# Altium project SOMA_25042022.PrjPcb (part 2 of 2)

## Sheet 04_BLE & WIFI module.SchDoc
size A4
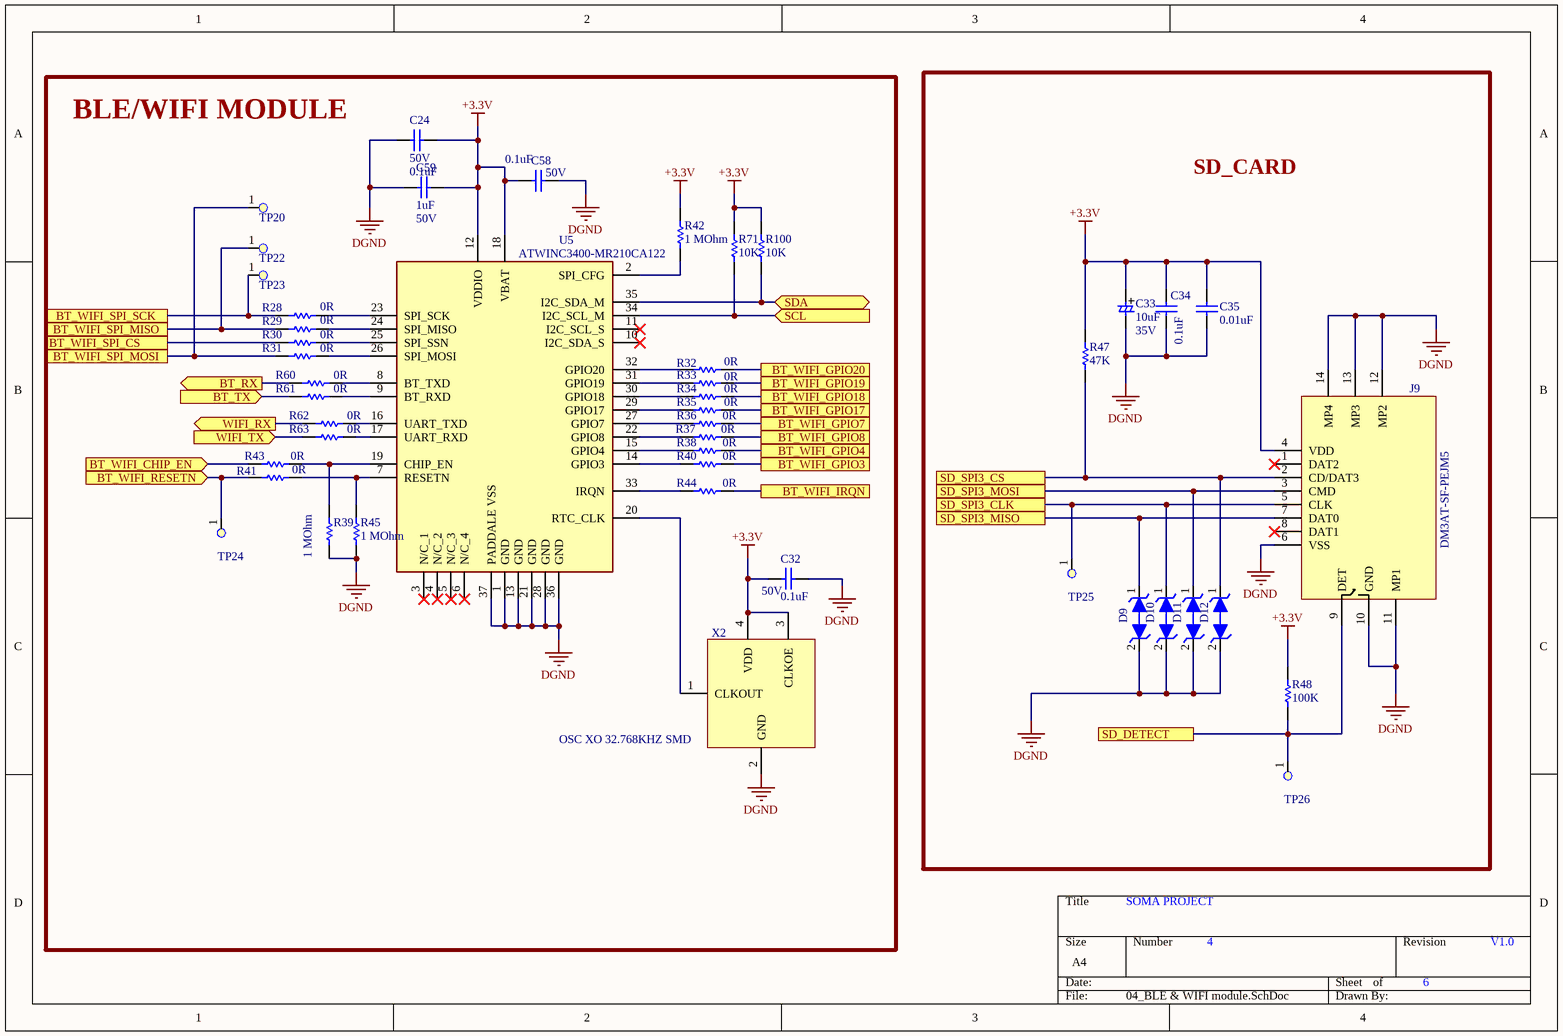
[diagram p3: 04_BLE & WIFI module.SchDoc]

### Parts
C24  Rating: 50V  [C0402]  (hidden comment: 0.1uF)
C32  Rating: 50V  [C0402]  (hidden comment: 0.1uF)
C33  Rating: 35V  [CAPAE430X540N]  (hidden comment: 10uF)
C34  0.1uF  [C0603]
C35  0.01uF  [C0402]
C58  Rating: 50V  [C0402]  (hidden comment: 0.1uF)
C59  value 1uF  Rating: 50V  [C0603]  (hidden comment: CAP CER 1UF 50V X5R 0603)
D9  TVS DIODE 3.3VWM 11.5VC SOD923  [SOD1006X40N_BI]  (value not drawn)
D10  TVS DIODE 3.3VWM 11.5VC SOD923  [SOD1006X40N_BI]  (value not drawn)
D11  TVS DIODE 3.3VWM 11.5VC SOD923  [SOD1006X40N_BI]  (value not drawn)
D12  TVS DIODE 3.3VWM 11.5VC SOD923  [SOD1006X40N_BI]  (value not drawn)
J9  value DM3AT-SF-PEJM5  [HIROSE_DM3AT-SF-PEJM5]  (hidden comment: CONN MICRO SD CARD PUSH-PUSH R/A)
R28  value 0R  [R0402]  (hidden comment: RES SMD 0 OHM JUMPER 1/16W 0402)
R29  value 0R  [R0402]  (hidden comment: RES SMD 0 OHM JUMPER 1/16W 0402)
R30  value 0R  [R0402]  (hidden comment: RES SMD 0 OHM JUMPER 1/16W 0402)
R31  value 0R  [R0402]  (hidden comment: RES SMD 0 OHM JUMPER 1/16W 0402)
R32  value 0R  [R0402]  (hidden comment: RES SMD 0 OHM JUMPER 1/16W 0402)
R33  value 0R  [R0402]  (hidden comment: RES SMD 0 OHM JUMPER 1/16W 0402)
R34  value 0R  [R0402]  (hidden comment: RES SMD 0 OHM JUMPER 1/16W 0402)
R35  value 0R  [R0402]  (hidden comment: RES SMD 0 OHM JUMPER 1/16W 0402)
R36  value 0R  [R0402]  (hidden comment: RES SMD 0 OHM JUMPER 1/16W 0402)
R37  value 0R  [R0402]  (hidden comment: RES SMD 0 OHM JUMPER 1/16W 0402)
R38  value 0R  [R0402]  (hidden comment: RES SMD 0 OHM JUMPER 1/16W 0402)
R39  1 MOhm  [R0603]
R40  value 0R  [R0402]  (hidden comment: RES SMD 0 OHM JUMPER 1/16W 0402)
R41  value 0R  [R0402]  (hidden comment: RES SMD 0 OHM JUMPER 1/16W 0402)
R42  1 MOhm  [R0603]
R43  value 0R  [R0402]  (hidden comment: RES SMD 0 OHM JUMPER 1/16W 0402)
R44  value 0R  [R0402]  (hidden comment: RES SMD 0 OHM JUMPER 1/16W 0402)
R45  1 MOhm  [R0603]
R47  47K  [R0402]
R48  100K  [R0402]
R60  value 0R  [R0402]  (hidden comment: RES SMD 0 OHM JUMPER 1/16W 0402)
R61  value 0R  [R0402]  (hidden comment: RES SMD 0 OHM JUMPER 1/16W 0402)
R62  value 0R  [R0402]  (hidden comment: RES SMD 0 OHM JUMPER 1/16W 0402)
R63  value 0R  [R0402]  (hidden comment: RES SMD 0 OHM JUMPER 1/16W 0402)
R71  10K  [R0402]
R100  10K  [R0402]
TP20  Test Point,1.6mm Diameter,SMD  [TP_63C]  (value not drawn)  (no BOM)
TP22  Test Point,1.6mm Diameter,SMD  [TP_63C]  (value not drawn)  (no BOM)
TP23  Test Point,1.6mm Diameter,SMD  [TP_63C]  (value not drawn)  (no BOM)
TP24  Test Point,1.6mm Diameter,SMD  [TP_63C]  (value not drawn)  (no BOM)
TP25  Test Point,1.6mm Diameter,SMD  [TP_63C]  (value not drawn)  (no BOM)
TP26  Test Point,1.6mm Diameter,SMD  [TP_63C]  (value not drawn)  (no BOM)
U5  value ATWINC3400-MR210CA122  [MICROCHIP_ATWINC3400-MR210xA]  (hidden comment: RX TXRX MODULE WIFI CHIP SMD)
X2  OSC XO 32.768KHZ SMD  [XTAL320X150X70-4N]

### Blocks framed on the sheet
BLE/WIFI MODULE: C24 C32 C58 C59 R28-R45 R60-R63 R71 R100 TP20 TP22-TP24 U5 X2
SD_CARD: C33-C35 D9-D12 J9 R47 R48 TP25 TP26

### Ports
BT_RX (out), BT_TX (in), BT_WIFI_CHIP_EN (in), BT_WIFI_GPIO3, BT_WIFI_GPIO4, BT_WIFI_GPIO7, BT_WIFI_GPIO8, BT_WIFI_GPIO17, BT_WIFI_GPIO18, BT_WIFI_GPIO19, BT_WIFI_GPIO20, BT_WIFI_IRQN, BT_WIFI_RESETN (in), BT_WIFI_SPI_CS, BT_WIFI_SPI_MISO, BT_WIFI_SPI_MOSI, BT_WIFI_SPI_SCK, SCL (in), SD_DETECT, SD_SPI3_CLK, SD_SPI3_CS, SD_SPI3_MISO, SD_SPI3_MOSI, SDA (bidir), WIFI_RX (out), WIFI_TX (in)

### Nets
+3.3V: C24.1 C32.2 C33.2 C34.2 C35.2 C58.2 C59.1 J9.4(VDD) R42.1 R47.2 R48.2 R71.2 R100.2 U5.12(VDDIO) U5.18(VBAT) X2.3(CLKOE) X2.4(VDD)
DGND: C24.2 C32.1 C33.1 C34.1 C35.1 C58.1 C59.2 D9.2(A) D10.2(A) D11.2(A) D12.2(A) J9.6(VSS) J9.10(GND) J9.11(MP1) J9.12(MP2) J9.13(MP3) J9.14(MP4) R39.2 R45.1 U5.1(GND) U5.13(GND) U5.21(GND) U5.28(GND) U5.36(GND) U5.37(PADDALE_VSS) X2.2(GND)
BT_RX: R60.1 ; port BT_RX
BT_TX: R61.1 ; port BT_TX
BT_WIFI_CHIP_EN: R43.1 ; port BT_WIFI_CHIP_EN
BT_WIFI_GPIO3: R40.2 ; port BT_WIFI_GPIO3
BT_WIFI_GPIO4: R38.2 ; port BT_WIFI_GPIO4
BT_WIFI_GPIO7: R36.2 ; port BT_WIFI_GPIO7
BT_WIFI_GPIO8: R37.2 ; port BT_WIFI_GPIO8
BT_WIFI_GPIO17: R35.2 ; port BT_WIFI_GPIO17
BT_WIFI_GPIO18: R34.2 ; port BT_WIFI_GPIO18
BT_WIFI_GPIO19: R33.2 ; port BT_WIFI_GPIO19
BT_WIFI_GPIO20: R32.2 ; port BT_WIFI_GPIO20
BT_WIFI_IRQN: R44.2 ; port BT_WIFI_IRQN
BT_WIFI_RESETN: R41.1 TP24.1 ; port BT_WIFI_RESETN
BT_WIFI_SPI_CS: R30.1 ; port BT_WIFI_SPI_CS
BT_WIFI_SPI_MISO: R29.1 TP22.1 ; port BT_WIFI_SPI_MISO
BT_WIFI_SPI_MOSI: R31.1 TP20.1 ; port BT_WIFI_SPI_MOSI
BT_WIFI_SPI_SCK: R28.1 TP23.1 ; port BT_WIFI_SPI_SCK
SCL: R71.1 U5.34(I2C_SCL_M) ; port SCL
SD_DETECT: J9.9(DET) R48.1 TP26.1 ; port SD_DETECT
SD_SPI3_CLK: D10.1(K) J9.5(CLK) TP25.1 ; port SD_SPI3_CLK
SD_SPI3_CS: D12.1(K) J9.2(CD/DAT3) R47.1 ; port SD_SPI3_CS
SD_SPI3_MISO: D9.1(K) J9.7(DAT0) ; port SD_SPI3_MISO
SD_SPI3_MOSI: D11.1(K) J9.3(CMD) ; port SD_SPI3_MOSI
SDA: R100.1 U5.35(I2C_SDA_M) ; port SDA
WIFI_RX: R62.1 ; port WIFI_RX
WIFI_TX: R63.1 ; port WIFI_TX
NetR28_2: R28.2 U5.23(SPI_SCK)
NetR29_2: R29.2 U5.24(SPI_MISO)
NetR30_2: R30.2 U5.25(SPI_SSN)
NetR31_2: R31.2 U5.26(SPI_MOSI)
NetR32_1: R32.1 U5.32(GPIO20)
NetR33_1: R33.1 U5.31(GPIO19)
NetR34_1: R34.1 U5.30(GPIO18)
NetR35_1: R35.1 U5.29(GPIO17)
NetR36_1: R36.1 U5.27(GPIO7)
NetR37_1: R37.1 U5.22(GPIO8)
NetR38_1: R38.1 U5.15(GPIO4)
NetR39_1: R39.1 R43.2 U5.19(CHIP_EN)
NetR40_1: R40.1 U5.14(GPIO3)
NetR41_2: R41.2 R45.2 U5.7(RESETN)
NetR42_2: R42.2 U5.2(SPI_CFG)
NetR44_1: R44.1 U5.33(IRQN)
NetR60_2: R60.2 U5.8(BT_TXD)
NetR61_2: R61.2 U5.9(BT_RXD)
NetR62_2: R62.2 U5.16(UART_TXD)
NetR63_2: R63.2 U5.17(UART_RXD)
NetU5_20: U5.20(RTC_CLK) X2.1(CLKOUT)

Not connected (* = marked no-connect by the designer): J9 1(DAT2)* 8(DAT1)*; U5 3(N/C_1)* 4(N/C_2)* 5(N/C_3)* 6(N/C_4)* 10(I2C_SDA_S)* 11(I2C_SCL_S)*

### Notes on the sheet
- SOMA PROJECT
- 4
- 6
- V1.0

### Library data of the parts
C24 C32 C58 = CAP CER 0.1UF 50V X7R 0402: Manufacturer: AVX; Manufacturer part Number: 04025C104KAT2A; Tolerance: ±10%; Distributor: Mouser; Package: 0402; Type: CAP; Operating Temperature: -55°C ~ 125°C; Distributor part Number: 581-04025C104KAT2A; Reference link: https://www.mouser.in/ProductDetail/AVX/04025C104KAT2A?qs=%2Fha2pyFaduhvAwOoQhW9hDDlPxePcbvdgYQJEdBTMGpxgpoTOSNvPA%3D%3D; Value: 0.1uF; Unit Price: ₹7.47
C33 = CAP ALUM 10UF 20% 35V SMD: Manufacturer: Panasonic; Manufacturer part Number: EEE-1VA100WR; Operating Temperature: 40°C ~ 85°C; Package: 0.169" L x 0.169" W (4.30mm x 4.30mm); Reference link: https://www.digikey.com/product-detail/en/panasonic-electronic-components/EEE-1VA100WR/PCE3948TR-ND/761836; Distributor: Digi-Key; Distributor part Number: PCE3948TR-ND; Type: CAP; Tolerance: ±20%; Value: 10uF; Unit Price: $0.08326
C34 = CAP CER 0.1UF 10V X7R 0603: Manufacturer: Würth Elektronik; Manufacturer part Number: 885012206020; Tolerance: ±10%; Operating Temperature: -55°C ~ 125°C; Reference link: https://www.digikey.com/en/products/detail/w%C3%BCrth-elektronik/885012206020/5453794; Package: 0603 (1608 Metric); Distributor: Digikey; Distributor part Number: 732-7939-1-ND; Type: CAP; Unit Price: $0.10000; Value: 0.1uF; Rating: 10V
C35 = CAP CER 0.01uF 50V X7R 0402: Manufacturer: Yageo; Manufacturer part Number: CC0402KRX7R9BB103; Tolerance: ±10%; Operating Temperature: -55°C ~ 125°C; Package: 0402; Distributor: Digikey; Reference link: https://www.digikey.in/product-detail/en/yageo/CC0402KRX7R9BB103/311-1349-1-ND/2103133; Distributor part Number: 311-1349-1-ND; Type: CAP; Rating: 50V; Value: 0.01uF; Unit Price: 0.00609
C59 = CAP CER 1UF 50V X5R 0603: Manufacturer: Taiyo Yuden; Manufacturer part Number: UMK107BJ105KA-T; Tolerance: ±10%; Operating Temperature: -55°C ~ 125°C; Reference link: https://www.digikey.in/product-detail/en/taiyo-yuden/UMK107BJ105KA-T/587-2400-2-ND/2178919; Package: 0603; Distributor: Digikey; Distributor part Number: 587-2400-2-ND; Type: CAP; Unit Price: 2.57370
D9-D12 = TVS DIODE 3.3VWM 11.5VC SOD923: 11.5V Clamp 2A (8/20µs) Ipp Tvs Diode Surface Mount SOD-923; Manufacturer Part Number: ESD9B3.3ST5G; Manufacturer: ON Semiconductor; Value: 3.3V 11.5V; Assembly Option: DNP; Tolerance: NA; Operating Temperature: -55°C to +150°C; Distributor: Digikey; Distributor part Number: ESD9B3.3ST5GOSTR-ND; Package: SOD-923; Rating: 3.3V 11.5V; Reference link: https://www.digikey.com/product-detail/en/on-semiconductor/ESD9B3.3ST5G/ESD9B3.3ST5GOSTR-ND/1973669; Type: TVS; Unit Price: $0.24000
J9 = CONN MICRO SD CARD PUSH-PUSH R/A: Manufacturer: Hirose Electric Co Ltd; Rating: NA; Unit Price: $2.50000; Distributor: Digikey; Distributor part Number: HR1964CT-ND; Manufacturer part Number: DM3AT-SF-PEJM5; Reference link: https://www.digikey.com/en/products/detail/hirose-electric-co-ltd/DM3AT-SF-PEJM5/2533565; Tolerance: NA; Type: Connector and Ejector
R28-R38 R40 R41 R43 R44 R60-R63 = RES SMD 0 OHM JUMPER 1/16W 0402: 0 Ohms Jumper 0.063W, 1/16W Chip Resistor 0402 (1005 Metric) Moisture Resistant Thick Film; Manufacturer: Yageo; Manufacturer part Number: RC0402JR-070RP; Distributor: Digikey; Distributor part Number: YAG1279TR-ND; Unit Price: 0.00377; Reference link: https://www.digikey.sg/product-detail/en/yageo/RC0402JR-070RP/YAG1279TR-ND/4935294; Type: RES; Rating: 0.063W, 1/16W; Package: 0402 (1005 Metric); Tolerance: Jumper; Part Status: Active; Operating Temperature: -55°C ~ 155°C; Size / Dimension: 0.039" L x 0.020" W (1.00mm x 0.50mm)
R39 R42 R45 = RES 1M OHM 1% 1/10W 0603: Manufacturer part Number: RC0603FR-131ML; Manufacturer: Yageo; Operating Temperature: -55°C ~ 155°C; Distributor: Digikey; Package: 0603 (1608 Metric); Type: RES; Distributor part Number: 13-RC0603FR-131MLCT-ND; Reference link: https://www.digikey.com/en/products/detail/yageo/RC0603FR-131ML/13694152; Rating: 1/10W; Unit Price: $0.10000; Value: 1 MOhm
R47 = RES SMD 47K OHM 5% 1/10W 0402: Manufacturer part Number: ERJ-2GEJ473X; Manufacturer: Panasonic Electronic Components; Assembly Option: DNP; Distributor: Digikey; Reference link: https://www.digikey.in/product-detail/en/panasonic-electronic-components/ERJ-2GEJ473X/P47KJCT-ND/147021; Type: RES; Distributor part Number: P47KJCT-ND; Rating: 1/10W; Tolerance: ±5%; Package: 0402; Operating Temperature: -55°C ~ 155°C; Value: 47K; Unit Price: 7.46000
R48 = RES SMD 100K OHM 1% 1/10W 0402: 100 kOhms ±1% 0.1W, 1/10W Chip Resistor 0402 (1005 Metric) Automotive AEC-Q200 Thick Film; Manufacturer: Panasonic Electronic Components; Manufacturer part Number: ERJ-2RKF1003X; Operating Temperature: -55°C ~ 155°C; Package: 0402; Distributor: Digikey; Type: RES; Reference link: https://www.digikey.in/product-detail/en/panasonic-electronic-components/ERJ-2RKF1003X/P100KLCT-ND/194127; Distributor part Number: P100KLCT-ND; Tolerance: ±1%; Rating: 1/10W; Value: 100K; Unit Price: 7.46000
R71 R100 = RES SMD 10K OHM 1% 1/10W 0402: 10 kOhms ±1% 0.1W, 1/10W Chip Resistor 0402 (1005 Metric) Automotive AEC-Q200 Thick Film; Manufacturer: Panasonic Electronic Components; Manufacturer part Number: ERJ-2RKF1002X; Operating Temperature: -55°C ~ 155°C; Reference link: https://www.digikey.in/product-detail/en/panasonic-electronic-components/ERJ-2RKF1002X/P10.0KLCT-ND/194119; Distributor: Digikey; Distributor part Number: P10.0KLCT-ND; Package: 0402; Type: RES; Rating: 1/10W; Cost: 0.00715; Tolerance: ±1%; Value: 10K
U5 = RX TXRX MODULE WIFI CHIP SMD: Manufacturer: Microchip Technology; Tolerance: NA; Rating: 2.5V ~ 4.2V; Distributor part Number: ATWINC3400-MR210CA122-ND; Unit Price: $11.93000; Reference link: https://www.digikey.com/en/products/detail/microchip-technology/ATWINC3400-MR210CA122/7898445; Type: IC; Manufacturer part Number: ATWINC3400-MR210CA122; Distributor: Digikey; Package: Module; Operating Temperature: -40°C ~ 85°C
X2 = OSC XO 32.768KHZ SMD: 32.768 kHz XO (Standard) CMOS Oscillator 1.2V ~ 5.5V Enable/Disable 4-SMD, No Lead; Manufacturer: Micro Crystal AG; Manufacturer part Number: OM-7604-C7-32.768KHZ-20PPM-TA-QC; Value: 1.2V ~ 5.5V,  0.5µA; Distributor: Digikey; Package: 4 SMD, No Lead; Operating Temperature: -40°C ~ 85°C; Type: Crystal; Distributor part Number: 2195-OM-7604-C7-32.768KHZ-20PPM-TA-QCCT-ND; Reference link: https://www.digikey.com/en/products/detail/micro-crystal-ag/OM-7604-C7-32-768KHZ-20PPM-TA-QC/10431069; Rating: 32.768kHz; Unit Price: $1.64000
TP20 TP22-TP26 = Test Point,1.6mm Diameter,SMD: AEMCI Part Number: *; Vendor: *; Vendor ID: *

## Sheet 05_MCU1.SchDoc
size A4
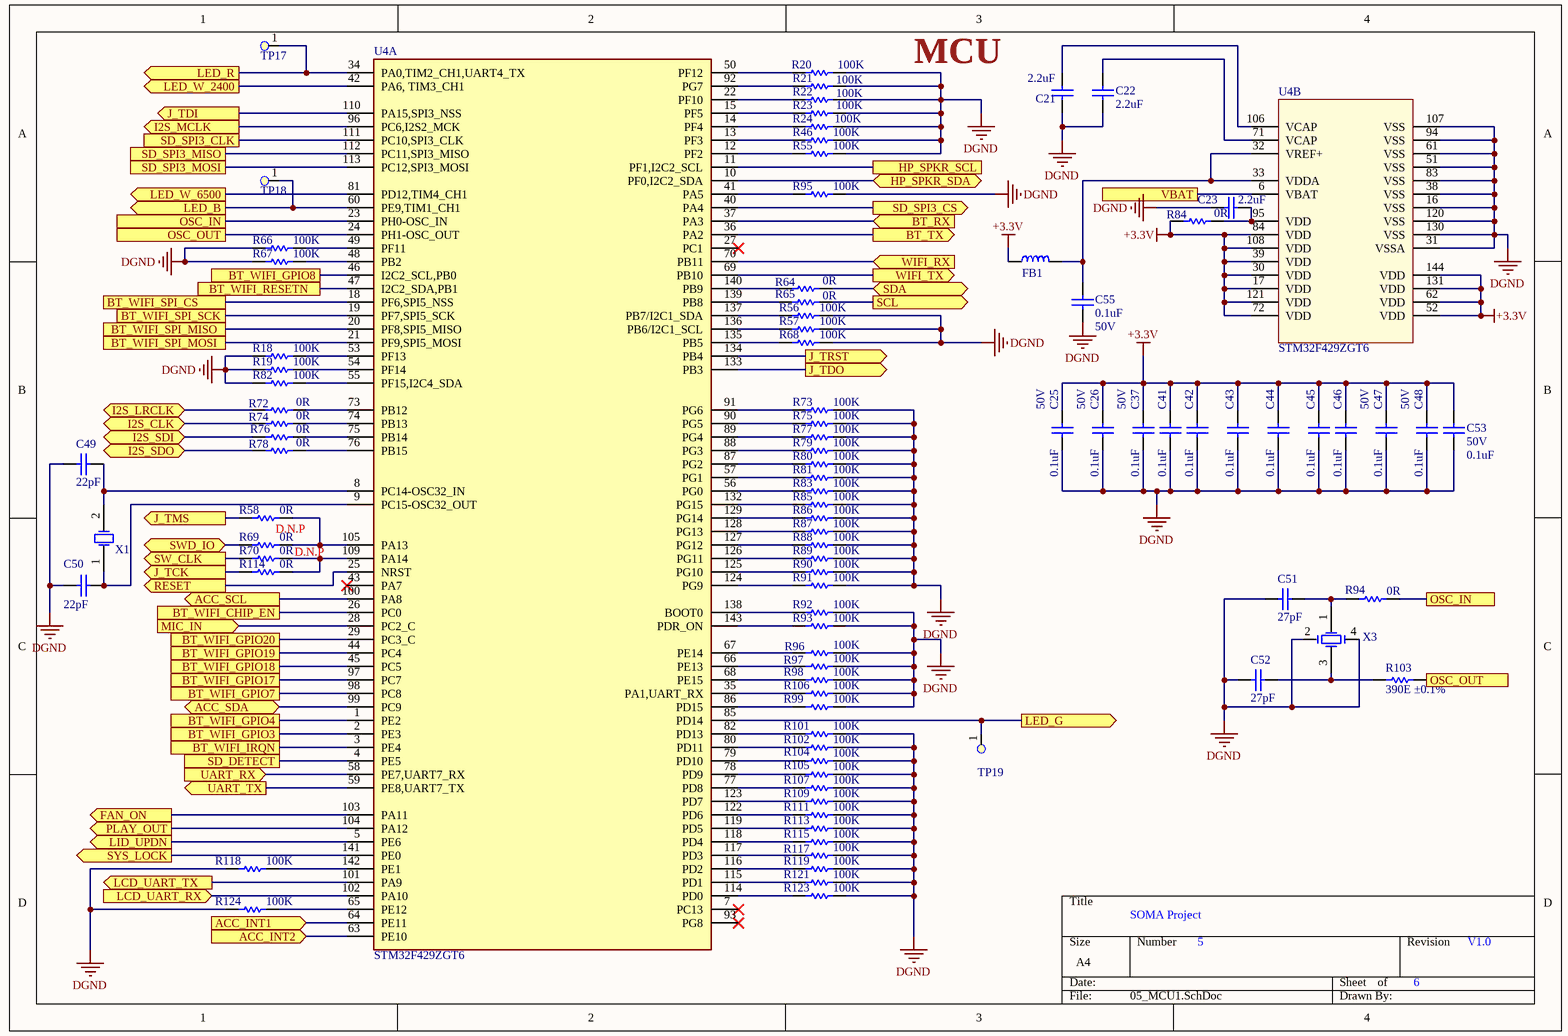
[diagram p4: 05_MCU1.SchDoc]

### Parts
C21  2.2uF  [C0402]
C22  2.2uF  [C0402]
C23  2.2uF  [C0402]
C25  Rating: 50V  [C0402]  (hidden comment: 0.1uF)
C26  Rating: 50V  [C0402]  (hidden comment: 0.1uF)
C37  Rating: 50V  [C0402]  (hidden comment: 0.1uF)
C41  0.1uF  [C0402]
C42  0.1uF  [C0402]
C43  0.1uF  [C0402]
C44  0.1uF  [C0402]
C45  0.1uF  [C0402]
C46  0.1uF  [C0402]
C47  Rating: 50V  [C0402]  (hidden comment: 0.1uF)
C48  Rating: 50V  [C0402]  (hidden comment: 0.1uF)
C49  22pF  [C0402]
C50  22pF  [C0402]
C51  27PF  [C0402]
C52  27PF  [C0402]
C53  Rating: 50V  [C0402]  (hidden comment: 0.1uF)
C55  Rating: 50V  [C0402]  (hidden comment: 0.1uF)
FB1  600 Ohms @ 100MHz  [FB0603]  (value not drawn)
R18  100K  [R0402]
R19  100K  [R0402]
R20  100K  [R0402]
R21  100K  [R0402]
R22  100K  [R0402]
R23  100K  [R0402]
R24  100K  [R0402]
R46  100K  [R0402]
R55  100K  [R0402]
R56  100K  [R0402]
R57  100K  [R0402]
R58  value 0R  [R0402]  (hidden comment: RES SMD 0 OHM JUMPER 1/16W 0402)
R64  value 0R  [R0402]  (hidden comment: RES SMD 0 OHM JUMPER 1/16W 0402)
R65  value 0R  [R0402]  (hidden comment: RES SMD 0 OHM JUMPER 1/16W 0402)
R66  100K  [R0402]
R67  100K  [R0402]
R68  100K  [R0402]
R69  value 0R  Assembly Option: D.N.P  [R0402]  (hidden comment: RES SMD 0 OHM JUMPER 1/16W 0402)
R70  value 0R  Assembly Option: D.N.P  [R0402]  (hidden comment: RES SMD 0 OHM JUMPER 1/16W 0402)
R72  value 0R  [R0402]  (hidden comment: RES SMD 0 OHM JUMPER 1/16W 0402)
R73  100K  [R0402]
R74  value 0R  [R0402]  (hidden comment: RES SMD 0 OHM JUMPER 1/16W 0402)
R75  100K  [R0402]
R76  value 0R  [R0402]  (hidden comment: RES SMD 0 OHM JUMPER 1/16W 0402)
R77  100K  [R0402]
R78  value 0R  [R0402]  (hidden comment: RES SMD 0 OHM JUMPER 1/16W 0402)
R79  100K  [R0402]
R80  100K  [R0402]
R81  100K  [R0402]
R82  100K  [R0402]
R83  100K  [R0402]
R84  value 0R  [R0402]  (hidden comment: RES SMD 0 OHM JUMPER 1/16W 0402)
R85  100K  [R0402]
R86  100K  [R0402]
R87  100K  [R0402]
R88  100K  [R0402]
R89  100K  [R0402]
R90  100K  [R0402]
R91  100K  [R0402]
R92  100K  [R0402]
R93  100K  [R0402]
R94  value 0R  [R0402]  (hidden comment: RES SMD 0 OHM JUMPER 1/16W 0402)
R95  100K  [R0402]
R96  100K  [R0402]
R97  100K  [R0402]
R98  100K  [R0402]
R99  100K  [R0402]
R101  100K  [R0402]
R102  100K  [R0402]
R103  value 390E ±0.1%  [R0603]  (hidden comment: RES SMD 390 OHM 0.1% 1/5W 0603)
R104  100K  [R0402]
R105  100K  [R0402]
R106  100K  [R0402]
R107  100K  [R0402]
R109  100K  [R0402]
R111  100K  [R0402]
R113  100K  [R0402]
R114  value 0R  [R0402]  (hidden comment: RES SMD 0 OHM JUMPER 1/16W 0402)
R115  100K  [R0402]
R117  100K  [R0402]
R118  100K  [R0402]
R119  100K  [R0402]
R121  100K  [R0402]
R123  100K  [R0402]
R124  100K  [R0402]
TP17  Test Point,1.6mm Diameter,SMD  [TP_63C]  (value not drawn)  (no BOM)
TP18  Test Point,1.6mm Diameter,SMD  [TP_63C]  (value not drawn)  (no BOM)
TP19  Test Point,1.6mm Diameter,SMD  [TP_63C]  (value not drawn)  (no BOM)
U4  STM32F429ZGT6  [QFP50P2200X2200X160-144N]  (parts A,B of 2)
X1  32.7680KHZ  [XTAL320X150X90-2N]  (value not drawn)
X3  8MHz  [XTAL600X360X120-4N]  (value not drawn)

### Ports
ACC_INT1 (in), ACC_INT2 (in), ACC_SCL (out), ACC_SDA (bidir), BT_RX (in), BT_TX (out), BT_WIFI_CHIP_EN, BT_WIFI_GPIO3, BT_WIFI_GPIO4, BT_WIFI_GPIO7, BT_WIFI_GPIO8, BT_WIFI_GPIO17, BT_WIFI_GPIO18, BT_WIFI_GPIO19, BT_WIFI_GPIO20, BT_WIFI_IRQN, BT_WIFI_RESETN, BT_WIFI_SPI_CS, BT_WIFI_SPI_MISO, BT_WIFI_SPI_MOSI, BT_WIFI_SPI_SCK, FAN_ON (out), HP_SPKR_SCL, HP_SPKR_SDA (bidir), I2S_CLK (bidir), I2S_LRCLK (bidir), I2S_MCLK (out), I2S_SDI (bidir), I2S_SDO (bidir), J_TCK (out), J_TDI (out), J_TDO (out), J_TMS (out), J_TRST (out), LCD_UART_RX (in), LCD_UART_TX (out), LED_B (out), LED_G (out), LED_R (out), LED_W_2400 (out), LED_W_6500 (out), LID_UPDN (out), MIC_IN (in), OSC_IN, OSC_OUT, PLAY_OUT (out), RESET (out), SCL (out), SD_DETECT, SD_SPI3_CLK, SD_SPI3_CS (out), SD_SPI3_MISO, SD_SPI3_MOSI, SDA (bidir), SW_CLK (out), SWD_IO (bidir), SYS_LOCK (out), UART_RX (in), UART_TX (out), VBAT, WIFI_RX (in), WIFI_TX (out)

### Nets
+3.3V: C25.2 C26.2 C37.2 C41.2 C42.2 C43.2 C44.2 C45.2 C46.2 C47.2 C48.2 C53.2 FB1.2 R84.1 U4.17(VDD) U4.30(VDD) U4.39(VDD) U4.52(VDD) U4.62(VDD) U4.72(VDD) U4.84(VDD) U4.108(VDD) U4.121(VDD) U4.131(VDD) U4.144(VDD)
DGND: C21.2 C22.2 C23.1 C25.1 C26.1 C37.1 C41.1 C42.1 C43.1 C44.1 C45.1 C46.1 C47.1 C48.1 C49.1 C50.1 C51.1 C52.1 C53.1 C55.1 R18.1 R19.1 R20.2 R21.2 R22.2 R23.2 R24.2 R46.2 R55.2 R56.2 R57.2 R66.1 R67.1 R68.2 R73.2 R75.2 R77.2 R79.2 R80.2 R81.2 R82.1 R83.2 R85.2 R86.2 R87.2 R88.2 R89.2 R90.2 R91.2 R92.2 R93.2 R95.2 R96.2 R97.2 R98.2 R99.2 R101.2 R102.2 R104.2 R105.2 R106.2 R107.2 R109.2 R111.2 R113.2 R115.2 R117.2 R118.1 R119.2 R121.2 R123.2 R124.1 U4.16(VSS) U4.31(VSSA) U4.38(VSS) U4.51(VSS) U4.61(VSS) U4.83(VSS) U4.94(VSS) U4.107(VSS) U4.120(VSS) U4.130(VSS) X3.2 X3.4
ACC_INT1: U4.64(PE11) ; port ACC_INT1
ACC_INT2: U4.63(PE10) ; port ACC_INT2
ACC_SCL: U4.100(PA8) ; port ACC_SCL
ACC_SDA: U4.99(PC9) ; port ACC_SDA
BT_RX: U4.37(PA3) ; port BT_RX
BT_TX: U4.36(PA2) ; port BT_TX
BT_WIFI_CHIP_EN: U4.26(PC0) ; port BT_WIFI_CHIP_EN
BT_WIFI_GPIO3: U4.2(PE3) ; port BT_WIFI_GPIO3
BT_WIFI_GPIO4: U4.1(PE2) ; port BT_WIFI_GPIO4
BT_WIFI_GPIO7: U4.98(PC8) ; port BT_WIFI_GPIO7
BT_WIFI_GPIO8: U4.46(I2C2_SCL,PB0) ; port BT_WIFI_GPIO8
BT_WIFI_GPIO17: U4.97(PC7) ; port BT_WIFI_GPIO17
BT_WIFI_GPIO18: U4.45(PC5) ; port BT_WIFI_GPIO18
BT_WIFI_GPIO19: U4.44(PC4) ; port BT_WIFI_GPIO19
BT_WIFI_GPIO20: U4.29(PC3_C) ; port BT_WIFI_GPIO20
BT_WIFI_IRQN: U4.3(PE4) ; port BT_WIFI_IRQN
BT_WIFI_RESETN: U4.47(I2C2_SDA,PB1) ; port BT_WIFI_RESETN
BT_WIFI_SPI_CS: U4.18(PF6,SPI5_NSS) ; port BT_WIFI_SPI_CS
BT_WIFI_SPI_MISO: U4.20(PF8,SPI5_MISO) ; port BT_WIFI_SPI_MISO
BT_WIFI_SPI_MOSI: U4.21(PF9,SPI5_MOSI) ; port BT_WIFI_SPI_MOSI
BT_WIFI_SPI_SCK: U4.19(PF7,SPI5_SCK) ; port BT_WIFI_SPI_SCK
FAN_ON: U4.103(PA11) ; port FAN_ON
HP_SPKR_SCL: U4.11(PF1,I2C2_SCL) ; port HP_SPKR_SCL
HP_SPKR_SDA: U4.10(PF0,I2C2_SDA) ; port HP_SPKR_SDA
I2S_CLK: R74.1 ; port I2S_CLK
I2S_LRCLK: R72.1 ; port I2S_LRCLK
I2S_MCLK: U4.96(PC6,I2S2_MCK) ; port I2S_MCLK
I2S_SDI: R76.2 ; port I2S_SDI
I2S_SDO: R78.1 ; port I2S_SDO
J_TCK: R114.1 ; port J_TCK
J_TDI: U4.110(PA15,SPI3_NSS) ; port J_TDI
J_TDO: U4.133(PB3) ; port J_TDO
J_TMS: R58.1 ; port J_TMS
J_TRST: U4.134(PB4) ; port J_TRST
LCD_UART_RX: U4.102(PA10) ; port LCD_UART_RX
LCD_UART_TX: U4.101(PA9) ; port LCD_UART_TX
LED_B: TP18.1 U4.60(PE9,TIM1_CH1) ; port LED_B
LED_G: TP19.1 U4.85(PD14) ; port LED_G
LED_R: TP17.1 U4.34(PA0,TIM2_CH1,UART4_TX) ; port LED_R
LED_W_2400: U4.42(PA6,_TIM3_CH1) ; port LED_W_2400
LED_W_6500: U4.81(PD12,TIM4_CH1) ; port LED_W_6500
LID_UPDN: U4.5(PE6) ; port LID_UPDN
MIC_IN: U4.28(PC2_C) ; port MIC_IN
OSC_IN: R94.2 U4.23(PH0-OSC_IN) ; port OSC_IN
OSC_OUT: R103.2 U4.24(PH1-OSC_OUT) ; port OSC_OUT
PLAY_OUT: U4.104(PA12) ; port PLAY_OUT
RESET: U4.25(NRST) ; port RESET
SCL: R65.2 ; port SCL
SD_DETECT: U4.4(PE5) ; port SD_DETECT
SD_SPI3_CLK: U4.111(PC10,SPI3_CLK) ; port SD_SPI3_CLK
SD_SPI3_CS: U4.40(PA4) ; port SD_SPI3_CS
SD_SPI3_MISO: U4.112(PC11,SPI3_MISO) ; port SD_SPI3_MISO
SD_SPI3_MOSI: U4.113(PC12,SPI3_MOSI) ; port SD_SPI3_MOSI
SDA: R64.2 ; port SDA
SW_CLK: R70.1 ; port SW_CLK
SWD_IO: R69.1 ; port SWD_IO
SYS_LOCK: U4.141(PE0) ; port SYS_LOCK
UART_RX: U4.58(PE7,UART7_RX) ; port UART_RX
UART_TX: U4.59(PE8,UART7_TX) ; port UART_TX
VBAT: U4.6(VBAT) ; port VBAT
WIFI_RX: U4.70(PB11) ; port WIFI_RX
WIFI_TX: U4.69(PB10) ; port WIFI_TX
NetC21_1: C21.1 U4.106(VCAP)
NetC22_1: C22.1 U4.71(VCAP)
NetC23_2: C23.2 R84.2 U4.95(VDD)
NetC49_2: C49.2 U4.8(PC14-OSC32_IN) X1.2(OSC2)
NetC50_2: C50.2 U4.9(PC15-OSC32_OUT) X1.1(OSC1)
NetC51_2: C51.2 R94.1 X3.1(OSC1)
NetC52_2: C52.2 R103.1 X3.3(OSC2)
NetC55_2: C55.2 FB1.1 U4.32(VREF+) U4.33(VDDA)
NetR18_2: R18.2 U4.53(PF13)
NetR19_2: R19.2 U4.54(PF14)
NetR20_1: R20.1 U4.50(PF12)
NetR21_1: R21.1 U4.92(PG7)
NetR22_1: R22.1 U4.22(PF10)
NetR23_1: R23.1 U4.15(PF5)
NetR24_1: R24.1 U4.14(PF4)
NetR46_1: R46.1 U4.13(PF3)
NetR55_1: R55.1 U4.12(PF2)
NetR56_1: R56.1 U4.137(PB7/I2C1_SDA)
NetR57_1: R57.1 U4.136(PB6/I2C1_SCL)
NetR58_2: R58.2 R69.2 U4.105(PA13)
NetR64_1: R64.1 U4.140(PB9)
NetR65_1: R65.1 U4.139(PB8)
NetR66_2: R66.2 U4.49(PF11)
NetR67_2: R67.2 U4.48(PB2)
NetR68_1: R68.1 U4.135(PB5)
NetR70_2: R70.2 R114.2 U4.109(PA14)
NetR72_2: R72.2 U4.73(PB12)
NetR73_1: R73.1 U4.91(PG6)
NetR74_2: R74.2 U4.74(PB13)
NetR75_1: R75.1 U4.90(PG5)
NetR76_1: R76.1 U4.75(PB14)
NetR77_1: R77.1 U4.89(PG4)
NetR78_2: R78.2 U4.76(PB15)
NetR79_1: R79.1 U4.88(PG3)
NetR80_1: R80.1 U4.87(PG2)
NetR81_1: R81.1 U4.57(PG1)
NetR82_2: R82.2 U4.55(PF15,I2C4_SDA)
NetR83_1: R83.1 U4.56(PG0)
NetR85_1: R85.1 U4.132(PG15)
NetR86_1: R86.1 U4.129(PG14)
NetR87_1: R87.1 U4.128(PG13)
NetR88_1: R88.1 U4.127(PG12)
NetR89_1: R89.1 U4.126(PG11)
NetR90_1: R90.1 U4.125(PG10)
NetR91_1: R91.1 U4.124(PG9)
NetR92_1: R92.1 U4.138(BOOT0)
NetR93_1: R93.1 U4.143(PDR_ON)
NetR95_1: R95.1 U4.41(PA5)
NetR96_1: R96.1 U4.67(PE14)
NetR97_1: R97.1 U4.66(PE13)
NetR98_1: R98.1 U4.68(PE15)
NetR99_1: R99.1 U4.86(PD15)
NetR101_1: R101.1 U4.82(PD13)
NetR102_1: R102.1 U4.80(PD11)
NetR104_1: R104.1 U4.79(PD10)
NetR105_1: R105.1 U4.78(PD9)
NetR106_1: R106.1 U4.35(PA1,UART_RX)
NetR107_1: R107.1 U4.77(PD8)
NetR109_1: R109.1 U4.123(PD7)
NetR111_1: R111.1 U4.122(PD6)
NetR113_1: R113.1 U4.119(PD5)
NetR115_1: R115.1 U4.118(PD4)
NetR117_1: R117.1 U4.117(PD3)
NetR118_2: R118.2 U4.142(PE1)
NetR119_1: R119.1 U4.116(PD2)
NetR121_1: R121.1 U4.115(PD1)
NetR123_1: R123.1 U4.114(PD0)
NetR124_2: R124.2 U4.65(PE12)

Not connected (* = marked no-connect by the designer): U4 7(PC13)* 27(PC1)* 43(PA7)* 93(PG8)*

### Notes on the sheet
- MCU
- SOMA Project
- 5
- 6
- V1.0

### Library data of the parts
C21-C23 = CAP CER 2.2UF 25V X5R 0402: 2.2 µF ±10% 25V Ceramic Capacitor X5R 0402 (1005 Metric); Manufacturer: TDK Corporation; Manufacturer part Number: C1005X5R1E225K050BE; Type: CAP; Value: 2.2uF; Tolerance: ±10%; Operating Temperature: -55°C ~ 85°C; Package: 0402 (1005 Metric); Distributor: Digikey; Reference link: https://www.digikey.com/en/products/detail/tdk-corporation/C1005X5R1E225K050BE/7907740; Distributor part Number: 445-175216-1-ND; Unit Price: $0.38000; Rating: 25V
C25 C26 C37 C41-C48 C53 C55 = CAP CER 0.1UF 50V X7R 0402: as C24 on sheet 04_BLE & WIFI module; Distributor: Mouser; Package: 0402; Type: CAP; Operating Temperature: -55°C ~ 125°C; Distributor part Number: 581-04025C104KAT2A; Reference link: https://www.mouser.in/ProductDetail/AVX/04025C104KAT2A?qs=%2Fha2pyFaduhvAwOoQhW9hDDlPxePcbvdgYQJEdBTMGpxgpoTOSNvPA%3D%3D; Value: 0.1uF; Unit Price: ₹7.47
  C41-C46: Rating: 50V
C49 C50 = CAP CER 22PF 50V C0G/NP0 0402: Manufacturer: AVX Corporation; Manufacturer part Number: 04025A220JAT2A; Tolerance: ±5%; Assembly Option: DNP; Operating Temperature: -55°C ~ 125°C; Reference link: https://www.digikey.com/product-detail/en/avx-corporation/04025A220JAT2A/478-1074-1-ND/564106; Package: 0402; Distributor: Digikey; Distributor part Number: 478-1074-1-ND; Type: CAP; Value: 22pF; Rating: 50V; Unit Price: $0.10000
C51 C52 = CAP CER 27PF 50V C0G/NPO 0402: 27pF ±5% 50V Ceramic Capacitor C0G, NP0 0402 (1005 Metric); Manufacturer: Yageo; Manufacturer part Number: CC0402JRNPO9BN270; Type: CAP; Assembly Option: DNP; Distributor: Digikey; Distributor part Number: 311-1019-1-ND; Package: 0402; Operating Temperature: -55°C ~ 125°C; Tolerance: ±5%; Reference link: https://www.digikey.in/product-detail/en/yageo/CC0402JRNPO9BN270/311-1019-1-ND/302936; Value: 27pF; Rating: 50V; Unit Price: 0.00651
FB1 = FERRITE BEAD 600 OHM 0603 1LN: Manufacturer: Murata; Manufacturer part Number: BLM18AG601SN1D; Type: FB; Assembly Option: DNP; Value: 600 Ohms @ 100MHz; Distributor: Digikey; Package: 0603; Operating Temperature: -55°C ~ 125°C; Rating: 600 Ohms @ 100MHz; Distributor part Number: 490-1014-2-ND; Reference link: https://www.digikey.com/product-detail/en/murata-electronics-north-america/BLM18AG601SN1D/490-1014-2-ND/584225; Unit Price: $0.02306
R18-R24 R46 R55-R57 R66-R68 R73 R75 R77 R79-R83 R85-R93 R95-R99 R101 R102 R104-R107 R109 R111 R113 R115 R117-R119 R121 R123 R124 = RES SMD 100K OHM 1% 1/10W 0402: as R48 on sheet 04_BLE & WIFI module; Operating Temperature: -55°C ~ 155°C; Package: 0402; Distributor: Digikey; Type: RES; Reference link: https://www.digikey.in/product-detail/en/panasonic-electronic-components/ERJ-2RKF1003X/P100KLCT-ND/194127; Distributor part Number: P100KLCT-ND; Unit Price: 7.46000; Tolerance: ±1%; Rating: 1/10W; Value: 100K
R58 R64 R65 R69 R70 R72 R74 R76 R78 R84 R94 R114 = RES SMD 0 OHM JUMPER 1/16W 0402: as R28 on sheet 04_BLE & WIFI module; Distributor: Digikey; Distributor part Number: YAG1279TR-ND; Unit Price: 0.00377; Reference link: https://www.digikey.sg/product-detail/en/yageo/RC0402JR-070RP/YAG1279TR-ND/4935294; Type: RES; Rating: 0.063W, 1/16W; Package: 0402 (1005 Metric); Tolerance: Jumper; Part Status: Active; Operating Temperature: -55°C ~ 155°C; Size / Dimension: 0.039" L x 0.020" W (1.00mm x 0.50mm)
R103 = RES SMD 390 OHM 0.1% 1/5W 0603: Manufacturer: Panasonic; Manufacturer part Number: ERJ-PB3B3900V; Rating: 0.2W; Assembly Option: DNP; Distributor: Digikey; Package: 0603; Operating Temperature: -55°C ~ 155°C; Type: RES; Distributor part Number: P19924TR-ND; Reference link: https://www.digikey.in/product-detail/en/panasonic-electronic-components/ERJ-PB3B3900V/P19924TR-ND/6212707; Tolerance: ±0.1%; Unit Price: 0.02610
U4 = STM32F429ZGT6: ARM® Cortex®-M4 series Microcontroller IC 32-Bit Single-Core 180MHz 1MB (1M x 8) FLASH 144-LQFP (20x20); Manufacturer: STMicroelectronics; Categories: Embedded - Microcontrollers; Rating: 1.8V ~ 3.6V; Manufacturer Part Number: STM32F429ZGT6; Part Status: Active; Operating Temperature: *-40°C ~ 85°C (TA); Mounting Type: Surface Mount; Package / Case: 144-LQFP; Distributor: Digikey; Distributor Part Number: 497-17461-ND; Reference Link: https://www.digikey.com/en/products/detail/stmicroelectronics/STM32F429ZGT6/4357426; Unit Price: 21.55
X1 = CRYSTAL 32.7680KHZ 12.5PF SMD: Manufacturer: NDK America, Inc.; Manufacturer part Number: NX3215SA-32.768K-STD-MUA-8; Rating: 70 kOhms; Value: 32.768 kHz; Tolerance: ±20ppm; Distributor: Digikey; Package: 2-SMD, No Lead; Operating Temperature: -40°C ~ 85°C; Type: kHz Crystal (Tuning Fork); Distributor part Number: 644-1156-1-ND; Reference link: https://www.digikey.com/en/products/detail/ndk-america-inc/NX3215SA-32-768K-STD-MUA-8/2261469; Unit Price: $0.79000
X3 = CRYSTAL 8.0000MHZ 18PF SMD: Manufacturer: Abracon LLC; Manufacturer part Number: ABMM2-8.000MHZ-D1-T; Rating: 72 Ohms; Assembly Option: DNP; Tolerance: ±20ppm; Distributor: Digikey; Package: HC-49/US; Operating Temperature: -40°C ~ 85°C; Type: Crystal; Distributor part Number: 535-13477-2-ND; Reference link: https://www.digikey.com/product-detail/en/abracon-llc/ABMM2-8.000MHZ-D1-T/535-13477-2-ND/5980073; Value: 8MHz
TP17-TP19 = Test Point,1.6mm Diameter,SMD: AEMCI Part Number: *; Vendor: *; Vendor ID: *

## Sheet 06_ACCELEROMETER.SchDoc
size A4
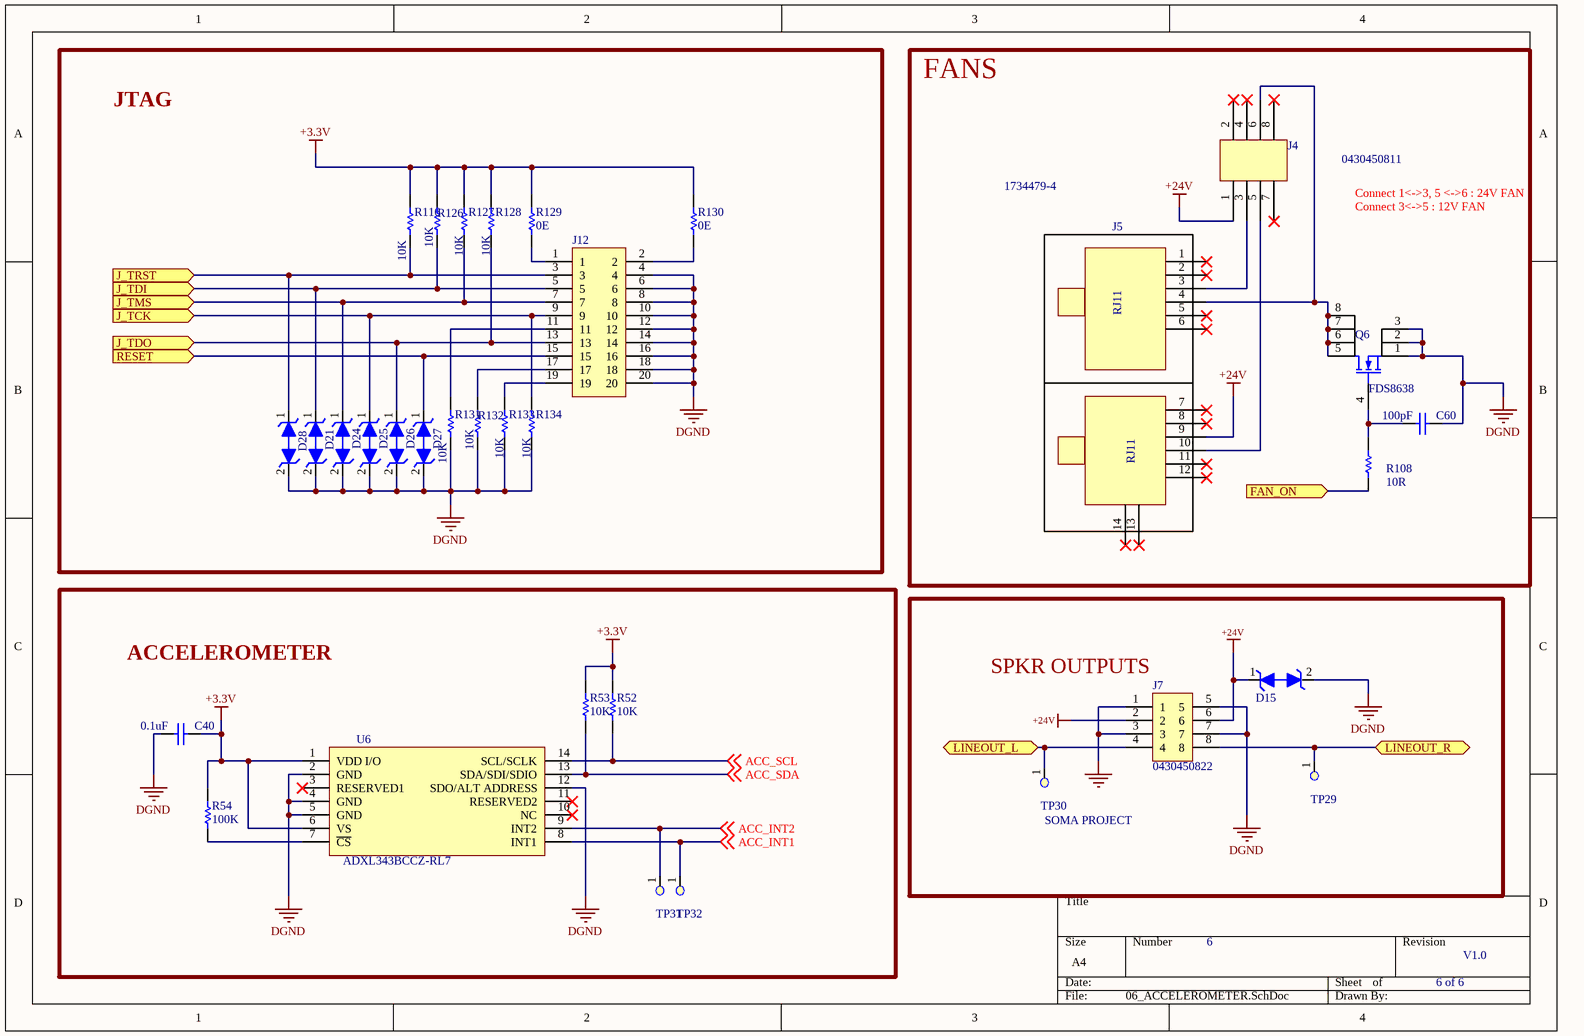
[diagram p5: 06_ACCELEROMETER.SchDoc]

### Parts
C40  0.1uF  [C0402]
C60  value 100pF  [C0402]  (hidden comment: CAP CER 100PF 50V C0G/NP0 0402)
D15  TVS DIODE 24VWM 38.9VC SMC  [SOD8060X260N_BI]  (value not drawn)
D21  TVS DIODE 3.3V 11.5V SOD923  [SOD1006X40N_BI]  (value not drawn)
D24  TVS DIODE 3.3V 11.5V SOD923  [SOD1006X40N_BI]  (value not drawn)
D25  TVS DIODE 3.3V 11.5V SOD923  [SOD1006X40N_BI]  (value not drawn)
D26  TVS DIODE 3.3V 11.5V SOD923  [SOD1006X40N_BI]  (value not drawn)
D27  TVS DIODE 3.3V 11.5V SOD923  [SOD1006X40N_BI]  (value not drawn)
D28  TVS DIODE 3.3V 11.5V SOD923  [SOD1006X40N_BI]  (value not drawn)
J4  value 0430450811  [MOLEX_0430450811]  (hidden comment: CONN HEADER SMD R/A 8POS 3MM)
J5  value 1734479-4  [TE_17344794]  (hidden comment: CONN MOD JACK 6P4C R/A UNSHLD)
J7  value 0430450822  [MOLEX_430450822]  (hidden comment: CONN HEADER R/A 8POS 3MM)
J12  SBH11-NBPC-D10-SM-BK  [SULLINS_SBH11-NBPC-D10-SM-BK]  (value not drawn)
Q6  value FDS8638  [SOIC127P600X175-8N]  (hidden comment: MOSFET N-CH 40V 18A 8SOIC)
R52  10K  [R0402]
R53  10K  [R0402]
R54  100K  [R0402]
R108  value 10R  [R0402]  (hidden comment: RES SMD 10 OHM 5% 1/16W 0402)
R116  10K  [R0402]
R126  10K  [R0402]
R127  10K  [R0402]
R128  10K  [R0402]
R129  0E  [R0603]
R130  0E  [R0603]
R131  10K  [R0402]
R132  10K  [R0402]
R133  10K  [R0402]
R134  10K  [R0402]
TP29  Test Point,1.6mm Diameter,SMD  [TP_63C]  (value not drawn)  (no BOM)
TP30  Test Point,1.6mm Diameter,SMD  [TP_63C]  (value not drawn)  (no BOM)
TP31  Test Point,1.6mm Diameter,SMD  [TP_63C]  (value not drawn)  (no BOM)
TP32  Test Point,1.6mm Diameter,SMD  [TP_63C]  (value not drawn)  (no BOM)
U6  Manufacturer part Number: ADXL343BCCZ-RL7  [LGA14R80P8X6_500X300X100N]  (hidden comment: ACCEL 2-16G I2C/SPI 14LGA)

### Blocks framed on the sheet
JTAG: D21 D24-D28 J12 R116 R126-R134
FANS: C60 J4 J5 Q6 R108
ACCELEROMETER: C40 R52-R54 TP31 TP32 U6
SPKR OUTPUTS: D15 J7 TP29 TP30

### Ports
FAN_ON (in), J_TCK (in), J_TDI (in), J_TDO (in), J_TMS (in), J_TRST (in), LINEOUT_L (bidir), LINEOUT_R (bidir), RESET (in)

### Nets
+3.3V: C40.1 R52.2 R53.2 R54.2 R116.2 R126.2 R127.2 R128.2 R129.2 R130.2 U6.1(VDD_I/O) U6.6(VS)
+24V: D15.1(K) J4.1 J5.9 J7.2 J7.6
DGND: C40.2 C60.1 D15.2(A) D21.2(A) D24.2(A) D25.2(A) D26.2(A) D27.2(A) D28.2(A) J7.5 J7.7 J12.4 J12.6 J12.8 J12.10 J12.12 J12.14 J12.16 J12.18 J12.20 Q6.1 Q6.2 Q6.3 R131.1 R132.1 R133.1 R134.1 U6.2(GND) U6.4(GND) U6.5(GND) U6.12(SDO/ALT_ADDRESS)
GND: J7.1 J7.3
ACC_INT1: TP32.1 U6.8(INT1) ; off-sheet ACC_INT1
ACC_INT2: TP31.1 U6.9(INT2) ; off-sheet ACC_INT2
ACC_SCL: R52.1 U6.14(SCL/SCLK) ; off-sheet ACC_SCL
ACC_SDA: R53.1 U6.13(SDA/SDI/SDIO) ; off-sheet ACC_SDA
FAN_ON: R108.1 ; port FAN_ON
J_TCK: D25.1(K) J12.9 R134.2 ; port J_TCK
J_TDI: D21.1(K) J12.5 R126.1 ; port J_TDI
J_TDO: D26.1(K) J12.13 R128.1 ; port J_TDO
J_TMS: D24.1(K) J12.7 R127.1 ; port J_TMS
J_TRST: D28.1(K) J12.3 R116.1 ; port J_TRST
LINEOUT_L: J7.4 TP30.1 ; port LINEOUT_L
LINEOUT_R: J7.8 TP29.1 ; port LINEOUT_R
RESET: D27.1(K) J12.15 ; port RESET
NetC60_2: C60.2 Q6.4 R108.2
NetJ4_3: J4.3 J5.3
NetJ4_5: J4.5 J5.10
NetJ4_6: J4.6 J5.4 Q6.5 Q6.6 Q6.7 Q6.8
NetJ12_1: J12.1 R129.1
NetJ12_2: J12.2 R130.1
NetJ12_11: J12.11 R131.2
NetJ12_17: J12.17 R132.2
NetJ12_19: J12.19 R133.2
NetR54_1: R54.1 U6.7(~{CS})

Not connected (* = marked no-connect by the designer): J4 2* 4* 7* 8*; J5 1* 2* 5* 6* 7* 8* 11* 12* 13* 14*; U6 3(RESERVED1)* 10(NC)* 11(RESERVED2)*

### Notes on the sheet
- (near TP30) SOMA PROJECT
- 6
- 6 of 6
- V1.0
- Labels drawn without touching a wire or pin: Connect 1<->3, 5 <->6 : 24V FAN, Connect 3<->5 : 12V FAN
- (in symbol CONN MOD JACK 6P4C R/A UNSHLD) RJ11

### Library data of the parts
C40 = CAP CER 0.1UF 50V X7R 0402_1: CAP CER 0.1UF 50V X7R 0402; Manufacturer: AVX Corporation; Manufacturer part Number: 04025C104KAT2A; Tolerance: ±10%; Package: 0402; Value: 0.1uF; Operating Temperature: -55°C ~ 125°C; Distributor: Digikey; Reference link: https://www.digikey.in/product-detail/en/avx-corporation/04025C104KAT2A/478-10043-1-ND/6564266; Distributor part Number: 478-10043-1-ND; Type: CAP; Unit Price: 7.46000; Rating: 50V
C60 = CAP CER 100PF 50V C0G/NP0 0402: 100 pF ±5% 50V Ceramic Capacitor C0G, NP0 0402 (1005 Metric); Manufacturer: KEMET; Manufacturer part Number: C0402C101J5GACTU; Tolerance: ±5%; Operating Temperature: -55°C ~ 125°C; Package: 0402 (1005 Metric); Distributor: Digikey; Distributor part Number: 399-3194-1-ND; Reference link: https://www.digikey.com/en/products/detail/kemet/C0402C101J5GACTU/569895?s=N4IgTCBcDaIMIAYAsCxwIwPQKQKwHEBBOAFQFUQBdAXyA; Unit Price: $0.10000; Type: CAP; Rating: 50V
D15 = TVS DIODE 24VWM 38.9VC SMC: 38.9V Clamp 77.2A Ipp Tvs Diode Surface Mount DO-214AB (SMC); Manufacturer: Bourns Inc.; Manufacturer part Number: SMLJ24CA-Q; Rating: 3000W (3kW); Tolerance: NA; Operating Temperature: -55°C ~ 150°C (TJ); Value: 38.9V Clamp 77.2A; Package: DO-214AB, SMC; Distributor: Digikey; Type: TVS; Reference link: https://www.digikey.com/en/products/detail/bourns-inc/SMLJ24CA-Q/8275811; Distributor part Number: SMLJ24CA-QCT-ND; Unit Price: $1.45000
D21 D24-D28 = Diode,ESD9B3.3ST5G: Manufacturer: ON Semiconductor; Assembly Option: DNP; Tolerance: NA; Manufacturer Part Number: ESD9B3.3ST5G; Operating Temperature: -55°C to +150°C; Value: 3.3V 11.5V; Cost: 0.03416; Distributor: Digikey; Distributor part Number: ESD9B3.3ST5GOSTR-ND; Package: SOD-923; Rating: 3.3V 11.5V; Reference link: https://www.digikey.com/product-detail/en/on-semiconductor/ESD9B3.3ST5G/ESD9B3.3ST5GOSTR-ND/1973669; Type: TVS
J4 = CONN HEADER SMD R/A 8POS 3MM: Connector Header Surface Mount, Right Angle 8 position 0.118" (3.00mm); Manufacturer: Molex; Rating: 600V 8A; Tolerance: NA; Unit Price: $5.40000; Distributor: Digikey; Distributor part Number: WM1834CT-ND; Manufacturer part Number: 0430450811; Package: Cut Tape (CT); Reference link: https://www.digikey.com/en/products/detail/molex/0430450811/4030798; Type: Header, Male Pin
J5 = CONN MOD JACK 6P4C R/A UNSHLD: Jack Modular Connector 6p4c (RJ11, RJ14) 90° Angle (Right) Unshielded Cat3; Manufacturer: TE Connectivity AMP Connectors; Tolerance: NA; Unit Price: $2.69000; Distributor: Digikey; Distributor part Number: A119279-ND; Manufacturer part Number: 1734479-4; Package: Tray; Rating: Cat3; Reference link: https://www.digikey.com/en/products/detail/te-connectivity-amp-connectors/1734479-4/4897898?s=N4IgTCBcDaIIwHYDMAWFCCcBaFIC6AvkA; Type: Jack, Through Hole
J7 = CONN HEADER R/A 8POS 3MM: Connector Header Through Hole, Right Angle 8 position 0.118" (3.00mm); Manufacturer: Molex; Rating: 600V,8A; Tolerance: NA; Package: Tray; Operating Temperature: -40°C ~ 105°C; Unit Price: $3.18000; Distributor: Digikey; Distributor part Number: WM2681-ND; Manufacturer part Number: 0430450822; Reference link: https://www.digikey.com/en/products/detail/molex/0430450822/1635032?s=N4IgTCBcDaIAwBYDMiCscAcYIF0C%2BQA; Type: Header
J12 = SBH11-NBPC-D10-SM-BK: Manufacturer: Sullins; Tolerance: NA; Unit Price: $1.68000; Distributor: Digikey; Distributor part Number: S9188-ND; Manufacturer part Number: SBH11-NBPC-D10-SM-BK; Reference link: https://www.digikey.at/product-detail/en/sullins-connector-solutions/SBH11-NBPC-D10-SM-BK/S9188-ND/1990081; Type: JTAG
Q6 = MOSFET N-CH 40V 18A 8SOIC: N-Channel 40 V 18A (Ta) 2.5W (Ta) Surface Mount 8-SOIC; Manufacturer: ON Semiconductor; Rating: 40 V 18A 2.5W; Tolerance: NA; Type: Transistors - FETs, MOSFETs - Single, N-Channel; Unit Price: $2.12000; Distributor: Digikey; Distributor part Number: FDS8638CT-ND; Manufacturer part Number: FDS8638; Package: 8-SOIC (0.154", 3.90mm Width); Reference link: https://www.digikey.com/en/products/detail/on-semiconductor/FDS8638/2051638?s=N4IgTCBcDaIGIBEDKAOAbAZhSAugXyA
R52 R53 R116 R126-R128 R131-R134 = RES SMD 10K OHM 1% 1/10W 0402: as R71 on sheet 04_BLE & WIFI module; Operating Temperature: -55°C ~ 155°C; Reference link: https://www.digikey.in/product-detail/en/panasonic-electronic-components/ERJ-2RKF1002X/P10.0KLCT-ND/194119; Distributor: Digikey; Distributor part Number: P10.0KLCT-ND; Package: 0402; Type: RES; Rating: 1/10W; Cost: 0.00715; Tolerance: ±1%; Value: 10K
R54 = RES SMD 100K OHM 1% 1/10W 0402: as R48 on sheet 04_BLE & WIFI module; Operating Temperature: -55°C ~ 155°C; Package: 0402; Distributor: Digikey; Type: RES; Reference link: https://www.digikey.in/product-detail/en/panasonic-electronic-components/ERJ-2RKF1003X/P100KLCT-ND/194127; Distributor part Number: P100KLCT-ND; Tolerance: ±1%; Rating: 1/10W; Value: 100K; Unit Price: 7.46000
R108 = RES SMD 10 OHM 5% 1/16W 0402: 10 Ohms ±5% 0.063W, 1/16W Chip Resistor 0402 (1005 Metric) Automotive AEC-Q200 Thick Film; Manufacturer: Vishay Dale; Manufacturer part Number: CRCW040210R0JNED; Rating: AEC-Q200  0.063W, 1/16W; Tolerance: ±5%; Distributor: Digikey; Package: 0402 (1005 Metric); Operating Temperature: -55°C ~ 155°C; Type: RES; Distributor part Number: 541-10JCT-ND; Reference link: https://www.digikey.com/en/products/detail/vishay-dale/CRCW040210R0JNED/1177520; Unit Price: $0.10000
R129 R130 = RES SMD 0 OHM JUMPER 1/10W 0603: Manufacturer part Number: RC0603JR-070RL; Manufacturer: Yageo; Operating Temperature: -55°C ~ 155°C; Distributor: Digikey; Package: 0603; Type: RES; Distributor part Number: 311-0.0GRCT-ND; Reference link: https://www.digikey.com/product-detail/en/yageo/RC0603JR-070RL/311-0.0GRCT-ND/729622; Rating: 1/10W; Cost: 0.00412; Value: 0E
U6 = ACCEL 2-16G I2C/SPI 14LGA: Accelerometer X, Y, Z Axis ±2g, 4g, 8g, 16g 0.05Hz ~ 1.6kHz 14-LGA (3x5); Manufacturer: Analog Devices Inc.; Tolerance: NA; Value: ADXL343BCCZ-RL7; Rating: 2V ~ 3.6V; Distributor: Digikey; Distributor part Number: ADXL343BCCZ-RL7CT-ND; Reference link: https://www.digikey.com/en/products/detail/analog-devices-inc/ADXL343BCCZ-RL7/3542894; Package: 14-VFLGA; Operating Temperature: -40°C ~ 85°C (TA); Type: Surface Mount; Unit Price: $3.10000
TP29-TP32 = Test Point,1.6mm Diameter,SMD: AEMCI Part Number: *; Vendor: *; Vendor ID: *

## Nets that join several sheets
+3.3V: 01_POWER SUPPLY (R9.2 TP3.1), 02_SPEAKER & LED STRIPS (5 pins), 03_CONNECTORS & AUDIO CONTROL INPUTS (10 pins), 04_BLE & WIFI module (17 pins), 05_MCU1 (25 pins), 06_ACCELEROMETER (12 pins)
+5V: 01_POWER SUPPLY (7 pins), 03_CONNECTORS & AUDIO CONTROL INPUTS (D20.1 J6.1 TP9.1)
+24V: 01_POWER SUPPLY (5 pins), 02_SPEAKER & LED STRIPS (C11.2 C36.2 J3.1 J3.2), 06_ACCELEROMETER (5 pins)
AGND: 01_POWER SUPPLY (R112.2), 02_SPEAKER & LED STRIPS (13 pins)
DGND: 01_POWER SUPPLY (9 pins), 02_SPEAKER & LED STRIPS (24 pins), 03_CONNECTORS & AUDIO CONTROL INPUTS (22 pins), 04_BLE & WIFI module (26 pins), 05_MCU1 (84 pins), 06_ACCELEROMETER (31 pins)
GND: 01_POWER SUPPLY (25 pins), 02_SPEAKER & LED STRIPS (6 pins), 03_CONNECTORS & AUDIO CONTROL INPUTS (Q7.2), 06_ACCELEROMETER (J7.1 J7.3)
BT_RX: 04_BLE & WIFI module (R60.1), 05_MCU1 (U4.37)
BT_TX: 04_BLE & WIFI module (R61.1), 05_MCU1 (U4.36)
BT_WIFI_CHIP_EN: 04_BLE & WIFI module (R43.1), 05_MCU1 (U4.26)
BT_WIFI_GPIO3: 04_BLE & WIFI module (R40.2), 05_MCU1 (U4.2)
BT_WIFI_GPIO4: 04_BLE & WIFI module (R38.2), 05_MCU1 (U4.1)
BT_WIFI_GPIO7: 04_BLE & WIFI module (R36.2), 05_MCU1 (U4.98)
BT_WIFI_GPIO8: 04_BLE & WIFI module (R37.2), 05_MCU1 (U4.46)
BT_WIFI_GPIO17: 04_BLE & WIFI module (R35.2), 05_MCU1 (U4.97)
BT_WIFI_GPIO18: 04_BLE & WIFI module (R34.2), 05_MCU1 (U4.45)
BT_WIFI_GPIO19: 04_BLE & WIFI module (R33.2), 05_MCU1 (U4.44)
BT_WIFI_GPIO20: 04_BLE & WIFI module (R32.2), 05_MCU1 (U4.29)
BT_WIFI_IRQN: 04_BLE & WIFI module (R44.2), 05_MCU1 (U4.3)
BT_WIFI_RESETN: 04_BLE & WIFI module (R41.1 TP24.1), 05_MCU1 (U4.47)
BT_WIFI_SPI_CS: 04_BLE & WIFI module (R30.1), 05_MCU1 (U4.18)
BT_WIFI_SPI_MISO: 04_BLE & WIFI module (R29.1 TP22.1), 05_MCU1 (U4.20)
BT_WIFI_SPI_MOSI: 04_BLE & WIFI module (R31.1 TP20.1), 05_MCU1 (U4.21)
BT_WIFI_SPI_SCK: 04_BLE & WIFI module (R28.1 TP23.1), 05_MCU1 (U4.19)
FAN_ON: 05_MCU1 (U4.103), 06_ACCELEROMETER (R108.1)
HP_SPKR_SCL: 02_SPEAKER & LED STRIPS (R15.1 U3.29), 05_MCU1 (U4.11)
HP_SPKR_SDA: 02_SPEAKER & LED STRIPS (R14.1 U3.27), 05_MCU1 (U4.10)
I2S_CLK: 02_SPEAKER & LED STRIPS (TP7.1 U3.24), 05_MCU1 (R74.1)
I2S_LRCLK: 02_SPEAKER & LED STRIPS (TP6.1 U3.23), 05_MCU1 (R72.1)
I2S_MCLK: 02_SPEAKER & LED STRIPS (R27.2), 05_MCU1 (U4.96)
I2S_SDI: 02_SPEAKER & LED STRIPS (U3.25), 05_MCU1 (R76.2)
I2S_SDO: 02_SPEAKER & LED STRIPS (U3.26), 05_MCU1 (R78.1)
J_TCK: 05_MCU1 (R114.1), 06_ACCELEROMETER (D25.1 J12.9 R134.2)
J_TDI: 05_MCU1 (U4.110), 06_ACCELEROMETER (D21.1 J12.5 R126.1)
J_TDO: 05_MCU1 (U4.133), 06_ACCELEROMETER (D26.1 J12.13 R128.1)
J_TMS: 05_MCU1 (R58.1), 06_ACCELEROMETER (D24.1 J12.7 R127.1)
J_TRST: 05_MCU1 (U4.134), 06_ACCELEROMETER (D28.1 J12.3 R116.1)
LCD_UART_RX: 03_CONNECTORS & AUDIO CONTROL INPUTS (R17.2 TP16.1), 05_MCU1 (U4.102)
LCD_UART_TX: 03_CONNECTORS & AUDIO CONTROL INPUTS (R16.2 TP15.1), 05_MCU1 (U4.101)
LED_B: 02_SPEAKER & LED STRIPS (R8.1), 05_MCU1 (TP18.1 U4.60)
LED_G: 02_SPEAKER & LED STRIPS (R7.1), 05_MCU1 (TP19.1 U4.85)
LED_R: 02_SPEAKER & LED STRIPS (R4.1), 05_MCU1 (TP17.1 U4.34)
LED_W_2400: 02_SPEAKER & LED STRIPS (R5.1), 05_MCU1 (U4.42)
LED_W_6500: 02_SPEAKER & LED STRIPS (R6.1), 05_MCU1 (U4.81)
LID_UPDN: 03_CONNECTORS & AUDIO CONTROL INPUTS (D4.3 R13.2 TP13.1), 05_MCU1 (U4.5)
LINEOUT_L: 02_SPEAKER & LED STRIPS (C10.2), 06_ACCELEROMETER (J7.4 TP30.1)
LINEOUT_R: 02_SPEAKER & LED STRIPS (C12.2), 06_ACCELEROMETER (J7.8 TP29.1)
MIC_IN: 02_SPEAKER & LED STRIPS (R59.2), 05_MCU1 (U4.28)
PLAY_OUT: 03_CONNECTORS & AUDIO CONTROL INPUTS (Q7.1 TP11.1), 05_MCU1 (U4.104)
RESET: 03_CONNECTORS & AUDIO CONTROL INPUTS (D19.1 J10.5), 05_MCU1 (U4.25), 06_ACCELEROMETER (D27.1 J12.15)
SCL: 04_BLE & WIFI module (R71.1 U5.34), 05_MCU1 (R65.2)
SD_DETECT: 04_BLE & WIFI module (J9.9 R48.1 TP26.1), 05_MCU1 (U4.4)
SD_SPI3_CLK: 04_BLE & WIFI module (D10.1 J9.5 TP25.1), 05_MCU1 (U4.111)
SD_SPI3_CS: 04_BLE & WIFI module (D12.1 J9.2 R47.1), 05_MCU1 (U4.40)
SD_SPI3_MISO: 04_BLE & WIFI module (D9.1 J9.7), 05_MCU1 (U4.112)
SD_SPI3_MOSI: 04_BLE & WIFI module (D11.1 J9.3), 05_MCU1 (U4.113)
SDA: 04_BLE & WIFI module (R100.1 U5.35), 05_MCU1 (R64.2)
SW_CLK: 03_CONNECTORS & AUDIO CONTROL INPUTS (D17.1 J10.2 R50.1), 05_MCU1 (R70.1)
SWD_IO: 03_CONNECTORS & AUDIO CONTROL INPUTS (D18.1 J10.4 R51.1), 05_MCU1 (R69.1)
SYS_LOCK: 03_CONNECTORS & AUDIO CONTROL INPUTS (D3.3 R12.2 TP12.1), 05_MCU1 (U4.141)
UART_RX: 01_POWER SUPPLY (D23.1 J11.2), 05_MCU1 (U4.58)
UART_TX: 01_POWER SUPPLY (D22.1 J11.1), 05_MCU1 (U4.59)
VBAT: 03_CONNECTORS & AUDIO CONTROL INPUTS (C38.2 R49.2 TP4.1), 05_MCU1 (U4.6)
WIFI_RX: 04_BLE & WIFI module (R62.1), 05_MCU1 (U4.70)
WIFI_TX: 04_BLE & WIFI module (R63.1), 05_MCU1 (U4.69)